# Altium schematic sheet rotaryEncoder.SchDoc
size A4
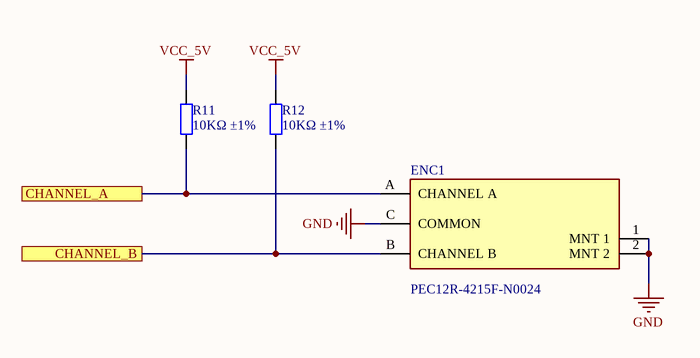
[diagram p0: rotaryEncoder.SchDoc]

## Parts
ENC1  PEC12R-4215F-N0024  [FP-PEC12R-4215F-N0024-MFG]
R11  10KΩ ±1%  [0603_R]
R12  10KΩ ±1%  [0603_R]

## Ports
CHANNEL_A, CHANNEL_B

## Nets
GND: ENC1.1(MNT_1) ENC1.2(MNT_2) ENC1.C(COMMON)
VCC_5V: R11.1 R12.1
CHANNEL_A: ENC1.A(CHANNEL_A) R11.2 ; port CHANNEL_A
CHANNEL_B: ENC1.B(CHANNEL_B) R12.2 ; port CHANNEL_B

## Library data of the parts
ENC1 = CMP-07421-000052-1: ROTARY ENCODER; RoHS Compliant: Yes; Width: 12.5mm; Length: 13.4mm
R11 R12 = 0603 10K (1002) 1%: Chip resistor; Manufacturer: Uniroyal Elec; PartNumber: 0603WAF1002T5E; Power: 1/10W; ComponentLink1Description: Supplier link; ComponentLink1URL: http://www.szlcsc.com/product/details_26547.html; Package: 0603; Supplier: LC; SuppliersPartNumber: C25804; Resistance: 10KΩ; Tolerance: 1%